# EAGLE design Lixie_II_Reverse_LED (EAGLE 7.7.0)
COMPANY: ADAFRUIT INDUSTRIES; DRAWN: KTOWN; REV: A
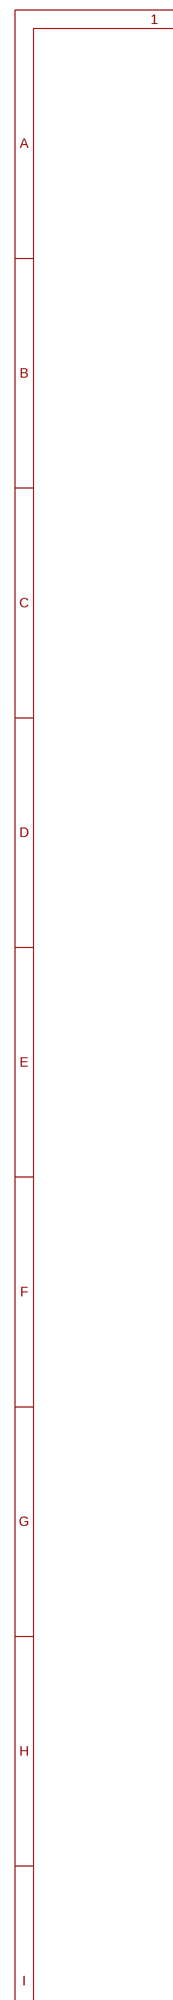
[diagram p0: schematic, sheet 1, part 1 of 2]
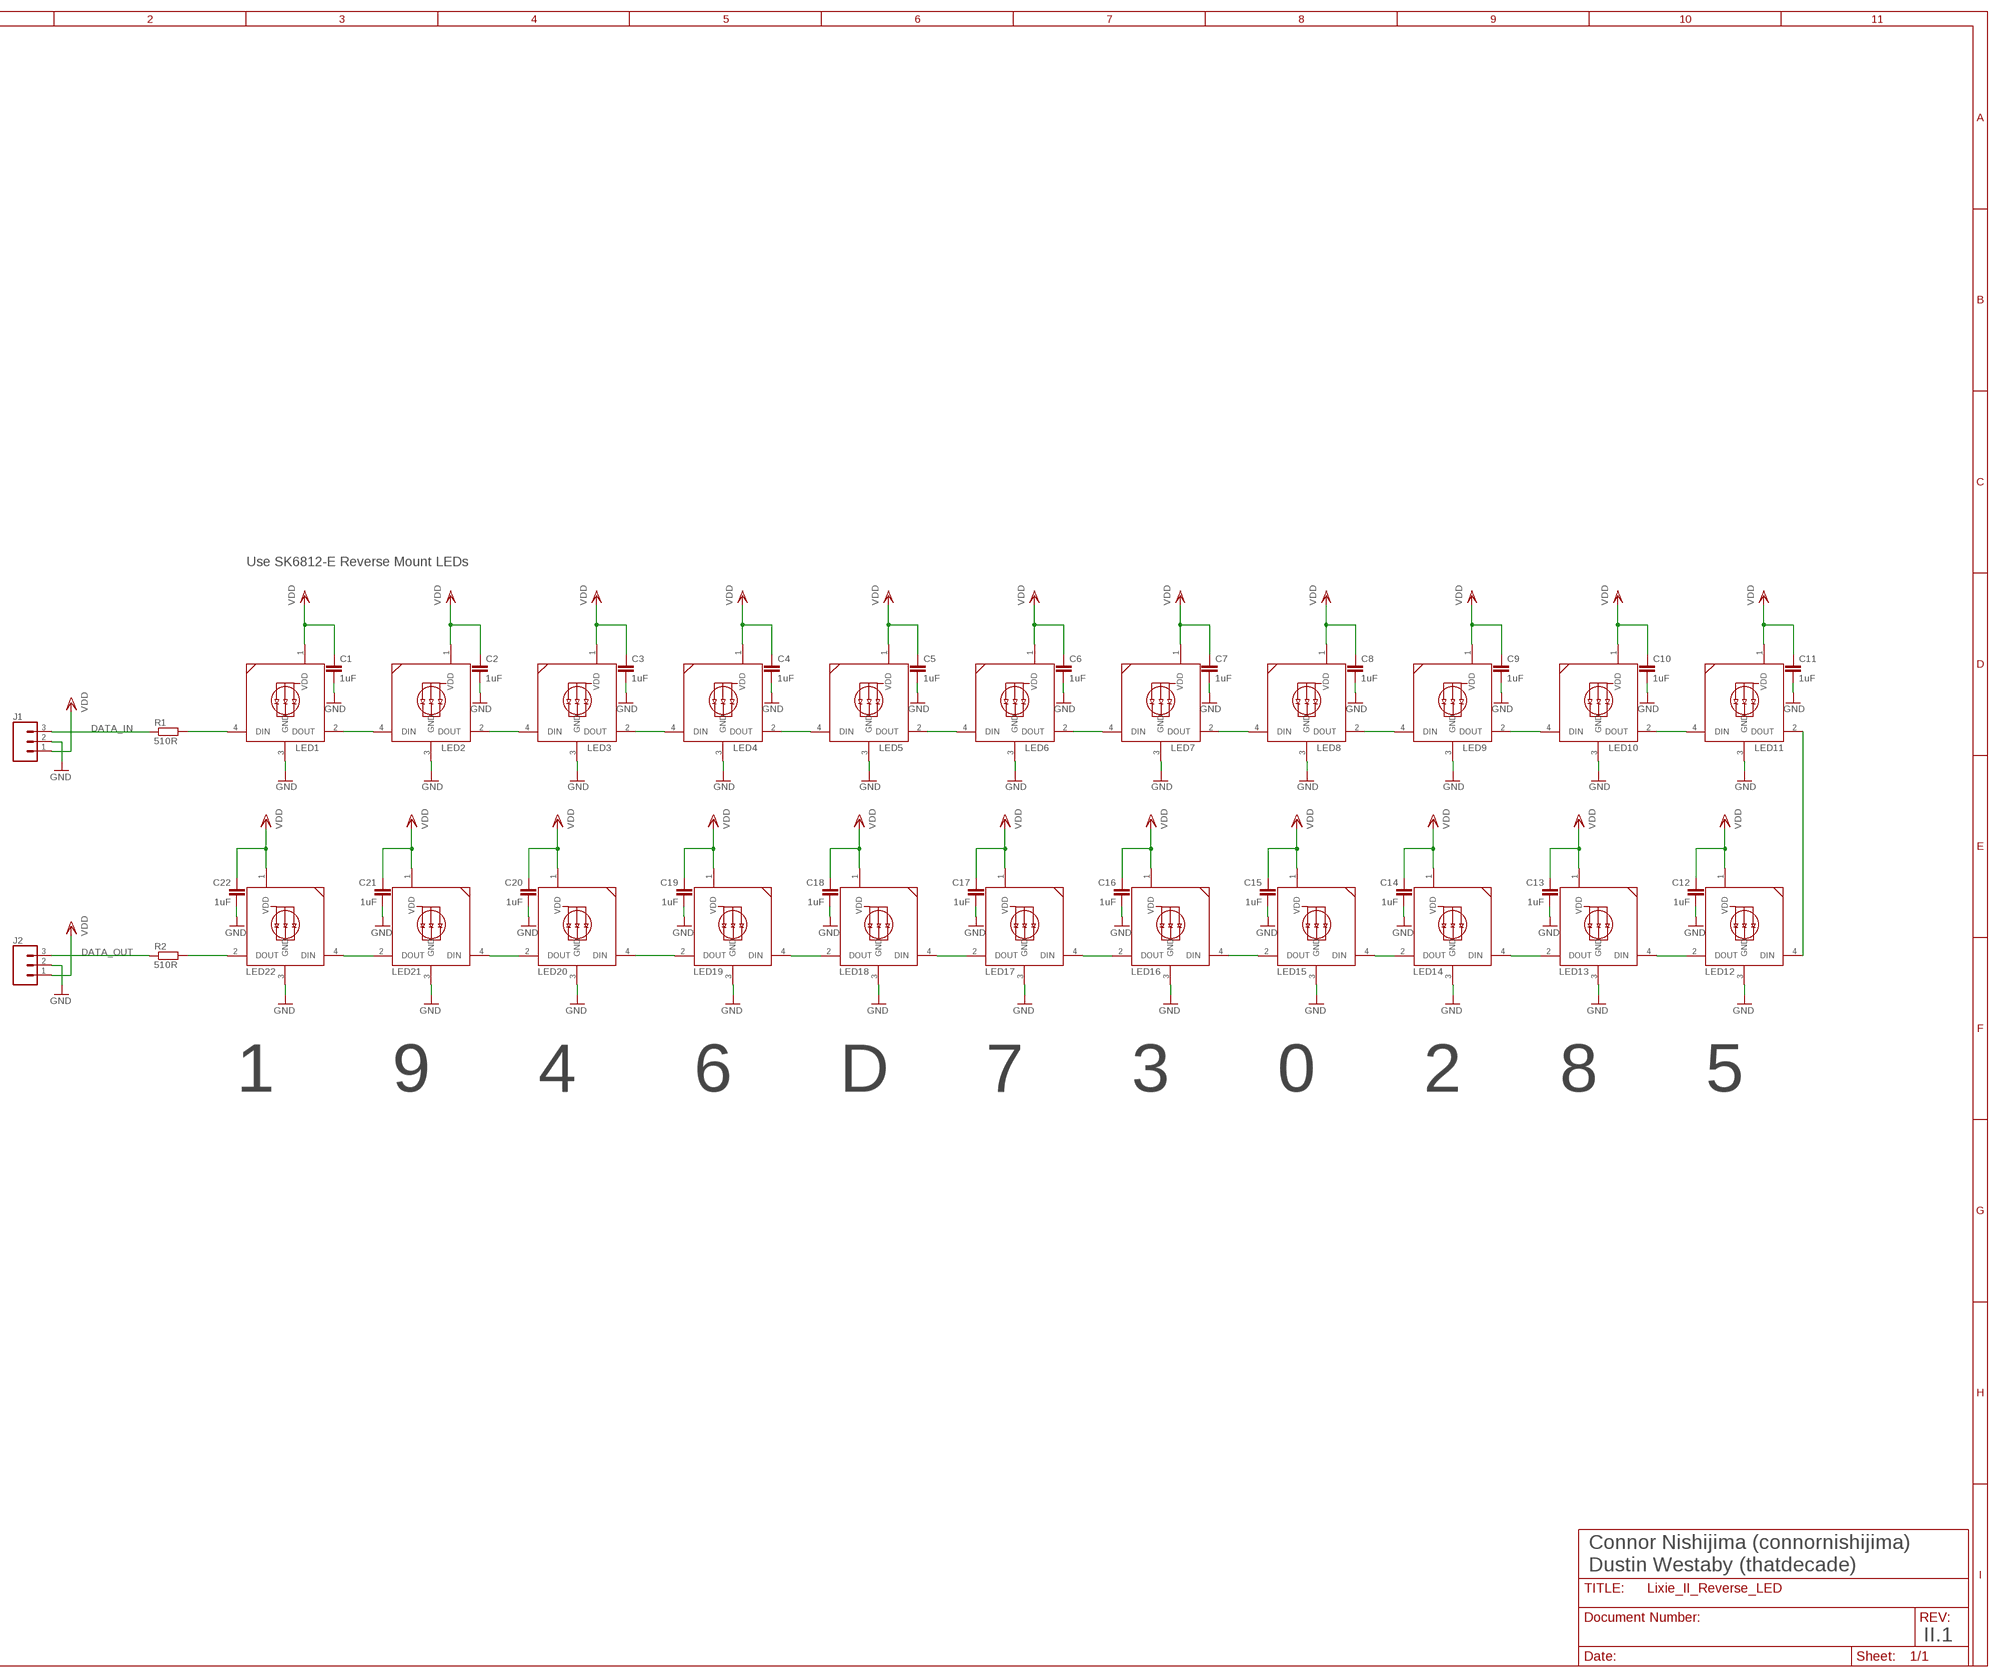
[diagram p1: schematic, sheet 1, part 2 of 2]

## Parts
C1  1uF  C_1UF/25V_0402  [C0402]
C2  1uF  C_1UF/25V_0402  [C0402]
C3  1uF  C_1UF/25V_0402  [C0402]
C4  1uF  C_1UF/25V_0402  [C0402]
C5  1uF  C_1UF/25V_0402  [C0402]
C6  1uF  C_1UF/25V_0402  [C0402]
C7  1uF  C_1UF/25V_0402  [C0402]
C8  1uF  C_1UF/25V_0402  [C0402]
C9  1uF  C_1UF/25V_0402  [C0402]
C10  1uF  C_1UF/25V_0402  [C0402]
C11  1uF  C_1UF/25V_0402  [C0402]
C12  1uF  C_1UF/25V_0402  [C0402]
C13  1uF  C_1UF/25V_0402  [C0402]
C14  1uF  C_1UF/25V_0402  [C0402]
C15  1uF  C_1UF/25V_0402  [C0402]
C16  1uF  C_1UF/25V_0402  [C0402]
C17  1uF  C_1UF/25V_0402  [C0402]
C18  1uF  C_1UF/25V_0402  [C0402]
C19  1uF  C_1UF/25V_0402  [C0402]
C20  1uF  C_1UF/25V_0402  [C0402]
C21  1uF  C_1UF/25V_0402  [C0402]
C22  1uF  C_1UF/25V_0402  [C0402]
J1  CONN_031X03_NO_SILK  [1X03_NO_SILK]
J2  CONN_031X03_NO_SILK  [1X03_NO_SILK]
LED1  SK6812MINI_REV  [SK6812-E-SMD]
LED2  SK6812MINI_REV  [SK6812-E-SMD]
LED3  SK6812MINI_REV  [SK6812-E-SMD]
LED4  SK6812MINI_REV  [SK6812-E-SMD]
LED5  SK6812MINI_REV  [SK6812-E-SMD]
LED6  SK6812MINI_REV  [SK6812-E-SMD]
LED7  SK6812MINI_REV  [SK6812-E-SMD]
LED8  SK6812MINI_REV  [SK6812-E-SMD]
LED9  SK6812MINI_REV  [SK6812-E-SMD]
LED10  SK6812MINI_REV  [SK6812-E-SMD]
LED11  SK6812MINI_REV  [SK6812-E-SMD]
LED12  SK6812MINI_REV  [SK6812-E-SMD]
LED13  SK6812MINI_REV  [SK6812-E-SMD]
LED14  SK6812MINI_REV  [SK6812-E-SMD]
LED15  SK6812MINI_REV  [SK6812-E-SMD]
LED16  SK6812MINI_REV  [SK6812-E-SMD]
LED17  SK6812MINI_REV  [SK6812-E-SMD]
LED18  SK6812MINI_REV  [SK6812-E-SMD]
LED19  SK6812MINI_REV  [SK6812-E-SMD]
LED20  SK6812MINI_REV  [SK6812-E-SMD]
LED21  SK6812MINI_REV  [SK6812-E-SMD]
LED22  SK6812MINI_REV  [SK6812-E-SMD]
R1  510R  R_510R_0402  [R0402]
R2  510R  R_510R_0402  [R0402]

## Nets
DATA_IN: J1.3 R1.1
DATA_OUT: J2.3 R2.1
GND: C1.2 C2.2 C3.2 C4.2 C5.2 C6.2 C7.2 C8.2 C9.2 C10.2 C11.2 C12.2 C13.2 C14.2 C15.2 C16.2 C17.2 C18.2 C19.2 C20.2 C21.2 C22.2 J1.2 J2.2 LED1.3(GND) LED2.3(GND) LED3.3(GND) LED4.3(GND) LED5.3(GND) LED6.3(GND) LED7.3(GND) LED8.3(GND) LED9.3(GND) LED10.3(GND) LED11.3(GND) LED12.3(GND) LED13.3(GND) LED14.3(GND) LED15.3(GND) LED16.3(GND) LED17.3(GND) LED18.3(GND) LED19.3(GND) LED20.3(GND) LED21.3(GND) LED22.3(GND)
N$1: LED1.4(DIN) R1.2
N$2: LED11.2(DOUT) LED12.4(DIN)
N$3: LED22.2(DOUT) R2.2
N$4: LED21.2(DOUT) LED22.4(DIN)
N$5: LED20.2(DOUT) LED21.4(DIN)
N$6: LED19.2(DOUT) LED20.4(DIN)
N$7: LED18.2(DOUT) LED19.4(DIN)
N$8: LED17.2(DOUT) LED18.4(DIN)
N$9: LED16.2(DOUT) LED17.4(DIN)
N$10: LED15.2(DOUT) LED16.4(DIN)
N$11: LED14.2(DOUT) LED15.4(DIN)
N$12: LED13.2(DOUT) LED14.4(DIN)
N$13: LED12.2(DOUT) LED13.4(DIN)
N$14: LED10.2(DOUT) LED11.4(DIN)
N$15: LED9.2(DOUT) LED10.4(DIN)
N$16: LED8.2(DOUT) LED9.4(DIN)
N$17: LED7.2(DOUT) LED8.4(DIN)
N$18: LED6.2(DOUT) LED7.4(DIN)
N$19: LED5.2(DOUT) LED6.4(DIN)
N$20: LED4.2(DOUT) LED5.4(DIN)
N$21: LED3.2(DOUT) LED4.4(DIN)
N$22: LED2.2(DOUT) LED3.4(DIN)
N$23: LED1.2(DOUT) LED2.4(DIN)
VDD: C1.1 C2.1 C3.1 C4.1 C5.1 C6.1 C7.1 C8.1 C9.1 C10.1 C11.1 C12.1 C13.1 C14.1 C15.1 C16.1 C17.1 C18.1 C19.1 C20.1 C21.1 C22.1 J1.1 J2.1 LED1.1(VDD) LED2.1(VDD) LED3.1(VDD) LED4.1(VDD) LED5.1(VDD) LED6.1(VDD) LED7.1(VDD) LED8.1(VDD) LED9.1(VDD) LED10.1(VDD) LED11.1(VDD) LED12.1(VDD) LED13.1(VDD) LED14.1(VDD) LED15.1(VDD) LED16.1(VDD) LED17.1(VDD) LED18.1(VDD) LED19.1(VDD) LED20.1(VDD) LED21.1(VDD) LED22.1(VDD)

## Notes on the sheet
- Use SK6812-E Reverse Mount LEDs
- 1 | 9 | 4 | 6 | D | 7 | 3 | 0 | 2 | 8 | 5
- Connor Nishijima (connornishijima)
- Dustin Westaby (thatdecade)
- II.1

## Library data of the parts
C1-C22 = JLC PCB Basic Parts_loc:C_: Capacitor General purpose SMD Capacitor; LCSC_DATASHEET: https://datasheet.lcsc.com/lcsc/1811091611_Samsung-Electro-Mechanics-CL05A105KA5NQNC_C52923.pdf; LCSC_PART: C52923; LCSC_ROTATION_CCW: 0; LCSC_STOCK: 6404174; PROPERTIES: 25V 1uF X5R ±10% 0402 ROHS
J1 J2 = SparkFun-Connectors:CONN_03: Multi connection point. Often used as Generic Header-pin footprint for 0.1 inch spaced/style header connections On any of the 0.1 inch spaced packages, you can populate with these: Break Away Headers - Straight <https://www.sparkfun.com/products/116> (PRT-00116) Break Away Male Headers - Right Angle <https://www.sparkfun.com/products/553> (PRT-00553) Female Headers <https://www.sparkfun.com/products/115> (PRT-00115) Break Away Headers - Machine Pin <https://www.sparkfun.com/products/117> (PRT-00117) Break Away Female Headers - Swiss Machine Pin <https://www.sparkfun.com/products/743> (PRT-00743) Stackable Header - 3 Pin (Female, 0.1") <https://www.sparkfun.com/products/13875> (PRT-13875) For SCREWTERMINALS and SPRING TERMINALS visit here: Screw Terimnals on SparkFun.com <https://www.sparkfun.com/search/results?term=Screw+Terminals> (5mm/3.5mm/2.54mm spacing) This device is also useful as a general connection point to wire up your design to another part of your project. Our various solder wires solder well into these plated through hole pads. Hook-Up Wire - Assortment (Stranded, 22 AWG) <https://www.sparkfun.com/products/11375> (PRT-11375) Hook-Up Wire - Assortment (Solid Core, 22 AWG) <https://www.sparkfun.com/products/11367> (PRT-11367) View the entire wire category on our website here <https://www.sparkfun.com/categories/141> Special notes: Molex polarized connector foot print use with SKU : PRT-08232 with associated crimp pins and housings.
LED1-LED22 = LIXIE_II:SK6812
R1 R2 = JLC PCB Basic Parts_loc:R_: Resistor General purpose SMD Resistor; LCSC_DATASHEET: https://datasheet.lcsc.com/lcsc/2110252230_UNI-ROYAL-Uniroyal-Elec-0402WGF5100TCE_C25123.pdf; LCSC_PART: C25123; LCSC_ROTATION_CCW: 0; LCSC_STOCK: 133820; PROPERTIES: ±1% 1/16W Thick Film Resistors 50V ±100ppm -55°C~+155°C 510Ohm 0402 ROHS

## Board
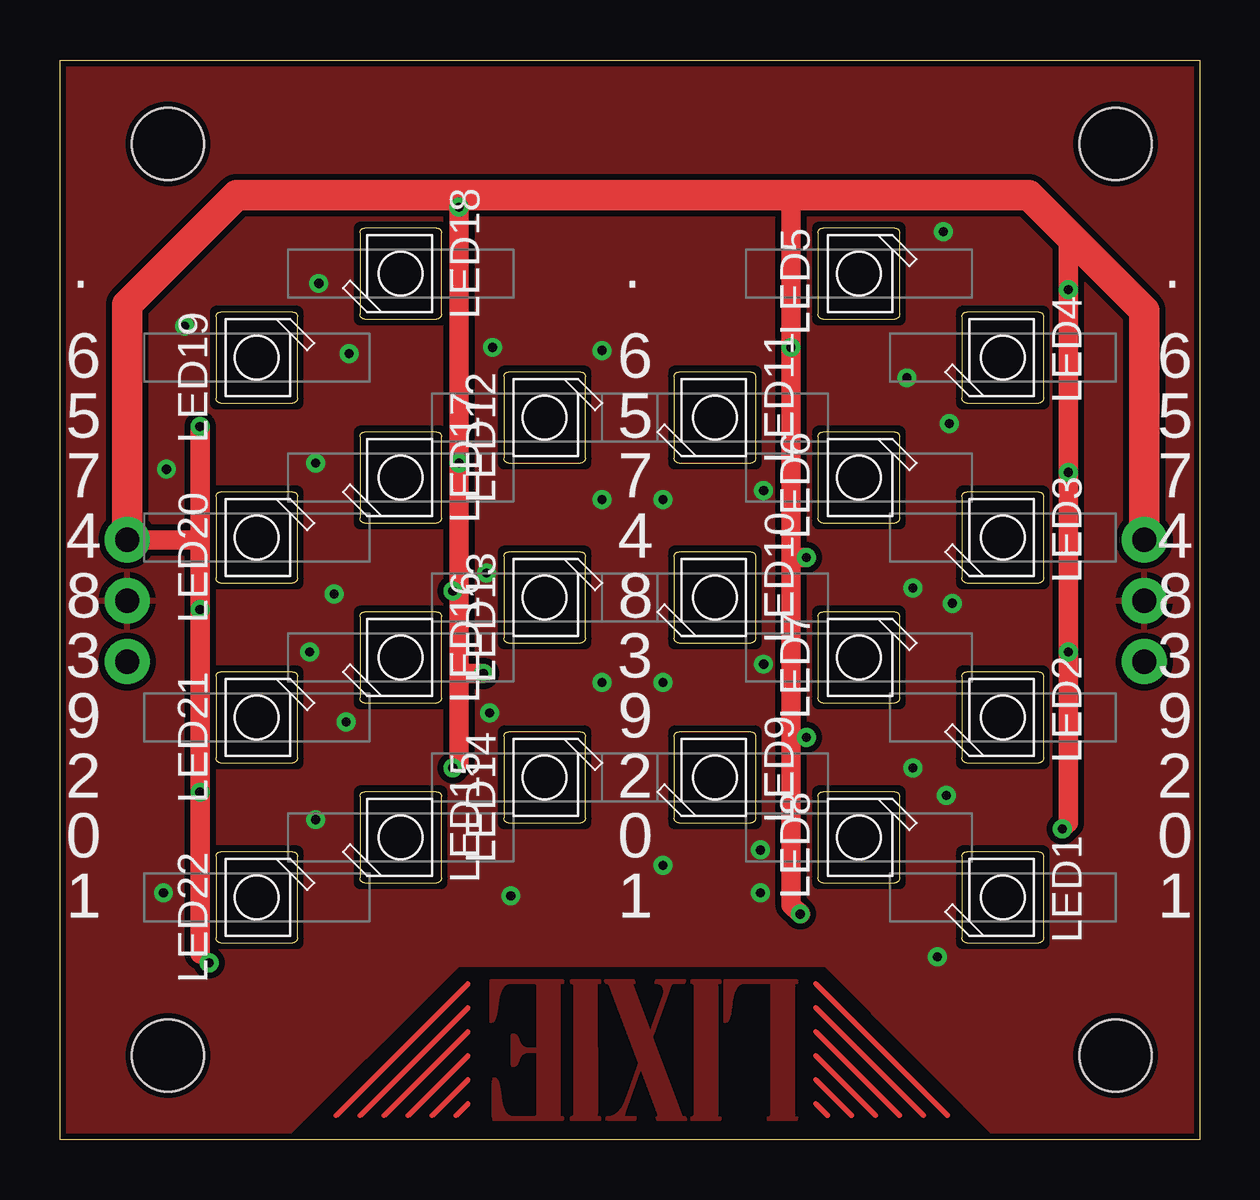
[diagram p2: board, top side]
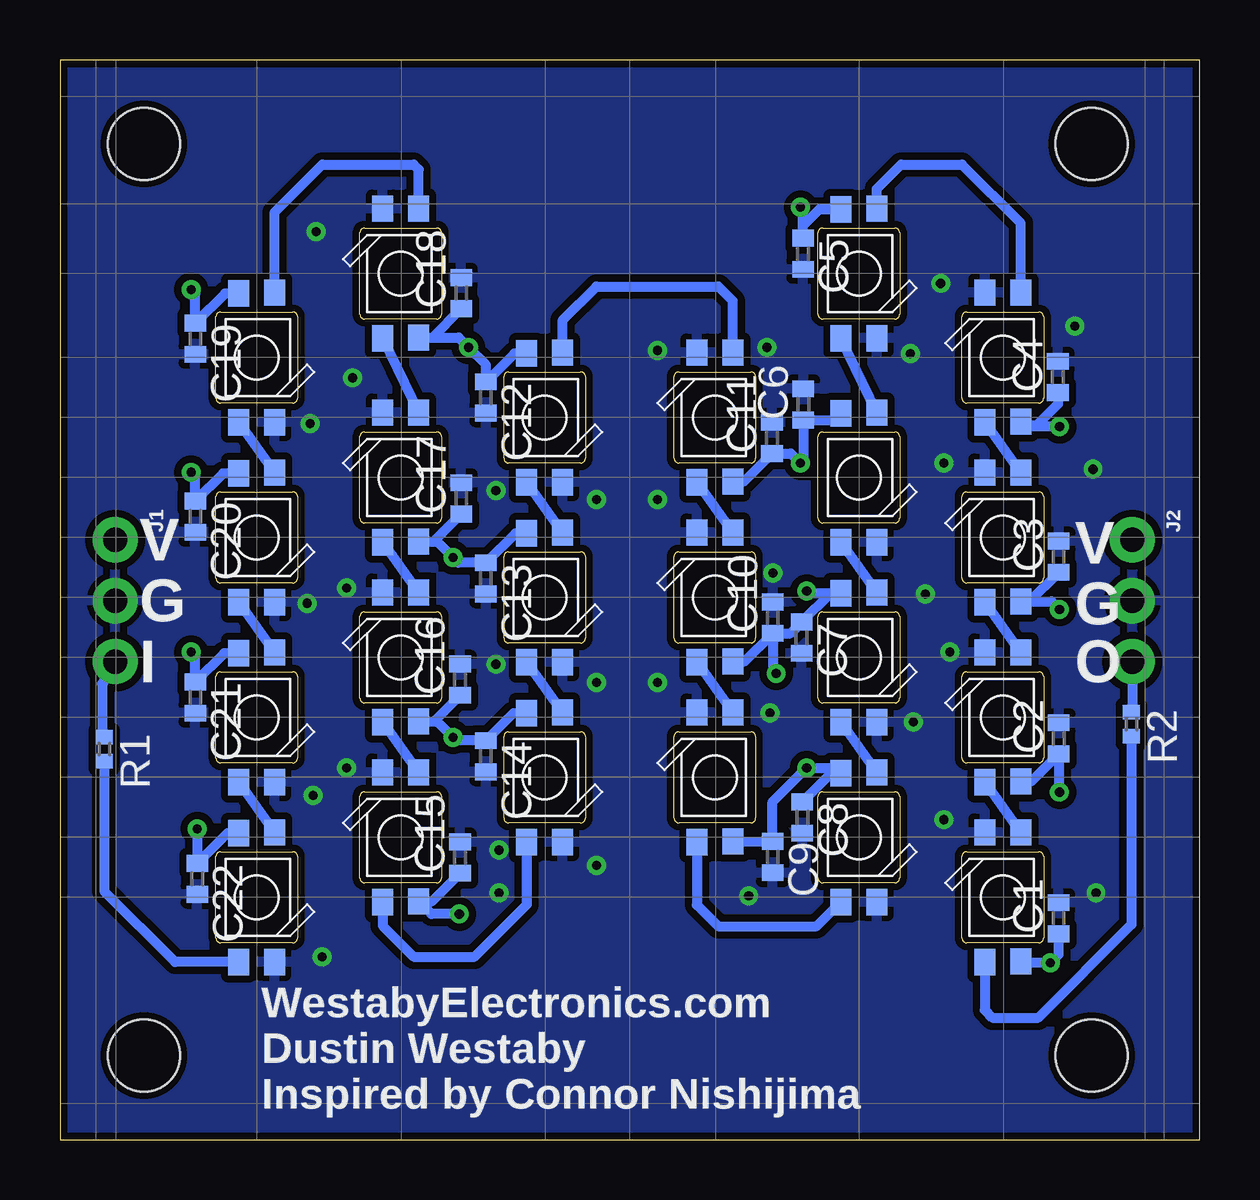
[diagram p3: board, bottom side, seen from below]

Size 47.5 x 45 mm. Coordinates in mm from the lower left corner, seen from the top.
Outline: 0,0 0,45 47.5,45 47.5,0 0,0
Copper layers (1*16): Top 0.035mm / dielectric 1.5mm / Bottom 0.035mm
Design rules "adafruit 7-7 *": minimum track width 7mil, minimum drill 15.5mil, track to track 7mil, track to pad 7mil, pad to pad 7mil, via to via 7mil, smd to smd 7mil, copper to edge 8mil, drill to drill 8mil, minimum pad ring 10mil, minimum via ring 8mil, stop-mask expansion 2mil, vias tented up to drill 20mil, thermal gap 10mil
Holes 3 mm at 44,3.5 4.5,3.5 4.5,41.5 44,41.5

### Footprints (pad centres in the part's own frame; a part is rotated, then mirrored left to right if it is on the bottom)
C0402 = smd 0.7 x 0.9: 1 -0.65,0; 2 0.65,0
1X03_NO_SILK = drill 1.016 pad 1.88: 1 0,0; 2 2.54,0; 3 5.08,0
SK6812-E-SMD = smd 1.092 x 0.889 bottom: 1 2.67,-0.75; 2 2.7,0.75; 3 -2.7,0.75; 4 -2.7,-0.75
R0402 = smd 0.6 x 0.7: 1 -0.5,0; 2 0.5,0

### Placement (x,y rotation side)
C1  5.88,9.23 90 bottom
C2  5.87,16.72 90 bottom
C3  5.87,24.29 90 bottom
C4  5.91,31.79 90 bottom
C5  16.53,36.92 270 bottom
C6  16.51,30.64 90 bottom
C7  16.59,20.92 270 bottom
C8  16.56,13.43 270 bottom
C9  17.79,11.77 270 bottom
C10  17.79,21.75 90 bottom
C11  17.82,29.25 90 bottom
C12  29.75,30.93 270 bottom
C13  29.75,23.39 270 bottom
C14  29.75,15.98 270 bottom
C15  30.82,11.75 90 bottom
C16  30.82,19.17 90 bottom
C17  30.77,26.73 90 bottom
C18  30.77,35.28 90 bottom
C19  41.86,33.38 270 bottom
C20  41.86,25.96 270 bottom
C21  41.86,18.43 270 bottom
C22  41.78,10.87 270 bottom
J1  45.2,25 270 bottom
J2  2.8,25 270 bottom
LED1  39.3,10.1 90 top
LED2  39.3,17.6 90 top
LED3  39.3,25.1 90 top
LED4  39.3,32.6 90 top
LED5  33.3,36.1 270 top
LED6  33.3,27.6 270 top
LED7  33.3,20.1 270 top
LED8  33.3,12.6 270 top
LED9  27.3,15.1 90 top
LED10  27.3,22.6 90 top
LED11  27.3,30.1 90 top
LED12  20.2,30.1 270 top
LED13  20.2,22.6 270 top
LED14  20.2,15.1 270 top
LED15  14.2,12.6 90 top
LED16  14.2,20.1 90 top
LED17  14.2,27.6 90 top
LED18  14.2,36.1 90 top
LED19  8.2,32.6 270 top
LED20  8.2,25.1 270 top
LED21  8.2,17.6 270 top
LED22  8.2,10.1 270 top
R1  45.65,16.27 270 bottom
R2  2.84,17.32 270 bottom

### Tracks (layer width: path | path; a pad name or v marks a point on that pad's centre or on a via)
DATA_IN
  Bottom 0.406: J1.3 45.74,19 45.74,16.82 45.7,16.82 R1.1
DATA_OUT
  Bottom 0.406: J2.3 2.8,17.85 R2.1
GND  (via drill 0.38)
  other vias: 18.79,10.16 4.31,10.29 10.66,13.34 11.93,17.4 10.41,20.32 11.42,22.73 4.44,27.94 10.66,28.19 12.06,32.77 5.2,33.91 10.79,35.69 25.14,11.43 25.14,19.05 22.6,19.05 25.14,26.67 22.6,26.67 37.08,29.84 35.3,31.75 35.55,22.99 37.21,22.35 35.55,15.49 36.95,14.35 36.57,7.62 29.2,10.29 29.33,27.05 18.03,33.02 22.6,32.89 17.77,23.62 17.9,17.78 29.33,19.81 36.82,37.85 29.2,12.06
  pour Bottom (isolate 0.305): 48,45.72 48,0 -0.26,0 -0.26,45.72
  pour Top (isolate 0.254): 48.5,45.5 48.5,-0.5 39.6,-0.5 31.87,7.25 16.62,7.25 8.83,-0.5 0,-0.5 0,45.5
N$1
  Bottom 0.406: LED1.4 42.7,7.4 45.65,10.35 R1.2
N$2
  Bottom 0.406: LED11.2 26.55,34.15 25.14,35.56 20.06,35.56 19.45,34.95 LED12.4
N$3
  Bottom 0.406: LED22.2 8.95,5.4 8.63,5.08 6.73,5.08 2.84,8.97 R2.2
N$4
  Bottom 0.406: LED22.4 LED21.2
N$5
  Bottom 0.406: LED21.4 LED20.2
N$6
  Bottom 0.406: LED20.4 LED19.2
N$7
  Bottom 0.406: LED18.2 13.45,39.63 12.44,40.64 9.9,40.64 7.45,38.19 LED19.4
N$8
  Bottom 0.406: LED17.2 LED18.4
N$9
  Bottom 0.406: LED16.2 LED17.4
N$10
  Bottom 0.406: LED15.2 LED16.4
N$11
  Bottom 0.406: LED14.2 20.95,9.78 20.06,8.89 15.96,8.89 LED15.4
N$12
  Bottom 0.406: LED13.2 LED14.4
N$13
  Bottom 0.406: LED13.4 LED12.2
N$14
  Bottom 0.406: LED10.2 LED11.4
N$15
  Bottom 0.406: LED10.4 LED9.2
N$16
  Bottom 0.406: LED8.2 34.05,8.91 32.76,7.62 30.22,7.62 28.05,9.79 LED9.4
N$17
  Bottom 0.406: LED7.2 LED8.4
N$18
  Bottom 0.406: LED6.2 LED7.4
N$19
  Bottom 0.406: LED5.2 LED6.4
N$20
  Bottom 0.406: LED4.2 38.55,38.66 36.57,40.64 32.76,40.64 32.55,40.43 LED5.4
N$21
  Bottom 0.406: LED4.4 LED3.2
N$22
  Bottom 0.406: LED3.4 LED2.2
N$23
  Bottom 0.406: LED2.4 LED1.2
N$24
  pour Top: 22.53,0.79 22.53,0.79 22.54,0.8 22.55,0.81 22.55,0.83 22.56,0.87 22.55,0.91 22.55,0.94 22.54,0.95 22.53,0.95 22.53,0.96 22.42,0.97 22.42,1.17 22.42,6.49 22.53,6.5 22.54,6.5 22.54,6.51 22.55,6.53 22.56,6.59 22.56,6.61 22.55,6.64 22.54,6.65 22.54,6.66 22.53,6.66 22.53,6.67 22.52,6.67 22.37,6.68 21.48,6.68 21.31,6.67 21.31,6.67 21.28,6.66 21.27,6.65 21.27,6.63 21.26,6.58 21.27,6.51 21.28,6.51 21.28,6.5 21.29,6.5 21.31,6.49 21.37,6.47 21.38,6.47 21.39,6.46 21.39,6.45 21.4,6.44 21.41,6.37 21.41,1.1 21.4,1.03 21.39,1.01 21.39,1 21.38,0.99 21.37,0.98 21.3,0.96 21.28,0.95 21.27,0.95 21.27,0.94 21.27,0.93 21.26,0.9 21.27,0.82 21.27,0.81 21.27,0.81 21.27,0.81 21.27,0.8 21.28,0.8 21.28,0.79 21.29,0.79 21.31,0.78 21.35,0.78 22.36,0.78 22.37,0.78 22.52,0.78 22.52,0.78
N$25
  pour Top: 355 corners
N$26
  pour Top: 30.74,0.79 30.74,0.8 30.75,0.81 30.75,0.82 30.76,0.87 30.76,0.92 30.75,0.94 30.75,0.95 30.74,0.95 30.73,0.96 30.64,0.97 30.64,1.15 30.64,6.29 30.64,6.48 30.73,6.49 30.74,6.5 30.74,6.5 30.75,6.51 30.75,6.52 30.76,6.53 30.76,6.59 30.76,6.63 30.75,6.65 30.74,6.66 30.74,6.66 30.73,6.67 30.73,6.67 30.72,6.67 30.56,6.68 27.88,6.68 27.71,6.67 27.68,6.67 27.65,6.64 27.65,6.48 27.65,5.08 27.65,4.91 27.65,4.9 27.66,4.89 27.67,4.88 27.7,4.87 27.71,4.87 27.71,4.87 27.72,4.87 27.73,4.87 27.73,4.87 27.75,4.87 27.76,4.88 27.77,4.88 27.79,4.89 27.8,4.89 27.81,4.9 27.82,4.91 27.84,4.92 27.85,4.93 27.86,4.94 27.86,4.95 27.87,4.96 27.88,4.96 27.9,5 27.95,5.15 27.95,5.18 27.96,5.2 27.97,5.23 27.97,5.26 27.98,5.28 27.99,5.34 27.99,5.39 28.02,5.63 28.04,5.76 28.05,5.82 28.06,5.87 28.06,5.89 28.07,5.92 28.12,6.09 28.15,6.17 28.17,6.22 28.22,6.31 28.25,6.35 28.27,6.37 28.28,6.39 28.3,6.4 28.31,6.41 28.33,6.43 28.4,6.47 28.43,6.48 28.44,6.48 28.46,6.49 28.47,6.49 28.48,6.49 29.61,6.49 29.61,1.2 29.61,1.04 29.59,0.99 29.49,0.95 29.49,0.95 29.48,0.95 29.48,0.94 29.47,0.93 29.47,0.92 29.47,0.91 29.46,0.84 29.47,0.83 29.47,0.82 29.48,0.81 29.49,0.8 29.5,0.79 29.51,0.78 29.52,0.78 29.67,0.78 30.58,0.78 30.73,0.79 30.73,0.79
N$27
  pour Top: 27.55,0.79 27.55,0.8 27.56,0.81 27.56,0.82 27.57,0.87 27.57,0.92 27.56,0.94 27.55,0.95 27.55,0.95 27.54,0.96 27.43,0.97 27.43,6.49 27.54,6.49 27.54,6.5 27.54,6.5 27.55,6.5 27.55,6.5 27.55,6.51 27.56,6.51 27.56,6.52 27.56,6.52 27.57,6.53 27.57,6.55 27.57,6.61 27.56,6.63 27.56,6.65 27.55,6.66 27.54,6.66 27.54,6.67 27.53,6.67 27.52,6.67 27.36,6.68 26.38,6.68 26.37,6.68 26.32,6.67 26.31,6.67 26.3,6.66 26.29,6.66 26.29,6.65 26.29,6.65 26.29,6.65 26.28,6.64 26.28,6.62 26.28,6.57 26.28,6.54 26.28,6.53 26.29,6.51 26.29,6.5 26.39,6.47 26.41,6.46 26.42,6.41 26.42,6.24 26.42,1.22 26.42,1.05 26.41,1.01 26.39,0.99 26.3,0.95 26.29,0.95 26.29,0.94 26.28,0.93 26.28,0.87 26.28,0.83 26.28,0.81 26.29,0.8 26.3,0.79 26.3,0.79 26.32,0.79 26.44,0.78 27.37,0.78 27.46,0.78 27.54,0.79 27.54,0.79
N$28
  pour Top: 204 corners
N$29
  Top 0.2: 31.5,6.5 37,1
N$30
  Top 0.2: 36,1 31.5,5.5
N$31
  Top 0.2: 31.5,4.5 35,1
N$32
  Top 0.2: 34,1 31.5,3.5
N$33
  Top 0.2: 31.5,2.5 33,1
N$34
  Top 0.2: 31.5,1.5 32,1
N$35
  Top 0.2: 17,6.5 11.5,1
N$36
  Top 0.2: 17,5.5 12.5,1
N$37
  Top 0.2: 17,4.5 13.5,1
N$38
  Top 0.2: 17,3.5 14.5,1
N$39
  Top 0.2: 17,2.5 15.5,1
N$40
  Top 0.2: 17,1.5 16.5,1
VDD  (via drill 0.38)
  Top 0.406: 5.84,7.75 v6.22,7.37 | 16.63,15.75 v16.38,15.49 | v31.11,16.76 30.73,16.76 30.47,16.51 | 16.76,19.43 16.63,19.56 | v16.38,22.86 16.63,23.11
  Top 0.813: 5.84,7.75 v5.84,14.48 v5.84,22.1 5.84,24.77 | 16.63,15.75 16.63,19.56 16.63,23.11 v16.63,28.19 v16.63,38.86 16.63,38.99 16.25,39.37 | v30.85,9.4 30.47,9.78 30.47,16.51 30.47,24.13 | v41.78,12.95 42.03,13.21 v42.03,20.32 v42.03,27.81 v42.03,35.43 42.03,37.21 42.29,37.47 | v17.65,19.43 16.76,19.43 | v5.84,29.72 5.84,24.77 | J2.1 5.6,25 5.84,24.77 | 30.22,39.37 30.47,39.12 v30.47,33.02 30.47,24.13 | v31.11,24.26 30.6,24.26 30.47,24.13
  Top 1.27: J2.1 2.8,34.81 7.36,39.37 16.25,39.37 30.22,39.37 40.38,39.37 42.29,37.47 45.2,34.55 J1.1
  Bottom 0.406: LED10.1 28.52,25.27 C13.1 30.89,24.04 v31.11,24.26 31.78,24.93 31.92,24.93 | 5.91,29.79 v5.84,29.72 7.24,29.72 LED19.1 7.31,29.79 6.78,29.79 5.91,30.66 C4.1 | LED22.1 7.39,7.37 v6.22,7.37 5.88,7.7 C1.1 | C5.1 16.53,38.1 | 16.53,38.1 16.53,38.76 v16.63,38.86 | 16.38,14.25 C8.1 15.36,15.27 LED15.1 15.17,15.49 v16.38,15.49 17.79,14.08 C9.1 LED14.1 | LED17.1 15.23,29.99 C6.1 16.51,28.31 v16.63,28.19 17.03,28.6 C11.1 18.99,27.43 LED12.1 | LED5.1 31.98,33.43 | 31.98,33.43 C18.1 | LED11.1 28.56,32.77 C12.1 29.75,32.29 v30.47,33.02 30.88,33.43 31.98,33.43 | LED6.1 31.92,24.93 | 31.92,24.93 C17.1 | LED4.1 40.62,35.27 C19.1 41.86,35.26 v42.03,35.43 | LED3.1 40.7,27.77 C20.1 41.86,27.64 v42.03,27.81 | LED2.1 40.66,20.27 C21.1 41.86,20.15 v42.03,20.32 | LED1.1 40.52,12.77 C22.1 v41.78,12.95 | C15.1 32,9.93 LED8.1 32.02,9.4 v30.85,9.4 | LED7.1 31.91,17.43 | 31.91,17.43 C16.1 | LED9.1 28.6,17.77 C14.1 30.97,16.63 v31.11,16.76 31.77,17.43 31.91,17.43 | LED13.1 18.96,19.93 C10.1 | LED21.1 7.01,14.93 C2.1 5.87,14.51 v5.84,14.48 | LED20.1 7.09,22.43 | 7.09,22.43 C3.1 | 7.09,22.43 6.17,22.43 v5.84,22.1 | LED18.1 15.86,38.77 16.53,38.1 | C10.1 17.79,19.57 v17.65,19.43 | C10.1 17.05,21.1 C7.1 15.39,22.77 LED16.1 16.29,22.77 v16.38,22.86

### Text on the board
tPlace: . | . | . | 6 | 6 | 6 | 5 | 5 | 5 | 7 | 7 | 7 | 4 | 4 | 4 | 8 | 8 | 8 | 3 | 3 | 3 | 9 | 9 | 9 | 2 | 2 | 2 | 0 | 0 | 0 | 1 | 1 | 1
bPlace: V | V | G | G | O | I | WestabyElectronics.com | Dustin Westaby | Inspired by Connor Nishijima
tStop: LIXIE II CLONE / REV.1.2
ENGRAVING: . | . | 6 | 6 | 5 | 5 | 7 | 7 | 4 | 4 | 8 | 8 | 3 | 3 | 9 | 9 | 2 | 2 | 0 | 0 | 1 | 1